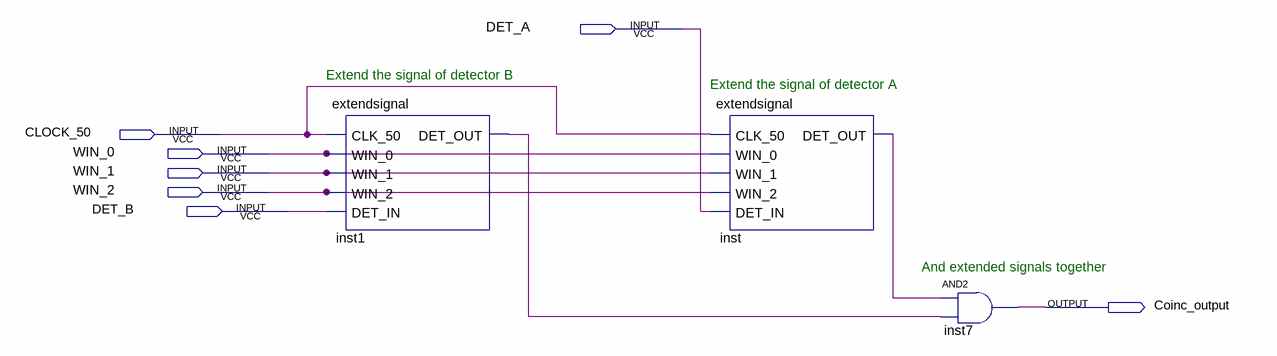
[diagram p0: schematic sheet]
// Quartus schematic coincidence_window.bdf as structural Verilog: 3 symbols, 7 pins
module coincidence_window (
  input  DET_A,
  input  CLOCK_50,
  input  WIN_0,
  input  WIN_1,
  input  WIN_2,
  input  DET_B,
  output Coinc_output
);

  wire inst1_det_out, inst_det_out;

  extendsignal inst1 (
    .CLK_50(CLOCK_50), .WIN_0(WIN_0), .WIN_1(WIN_1), .WIN_2(WIN_2), .DET_IN(DET_B), .DET_OUT(inst1_det_out));
  extendsignal inst (
    .CLK_50(CLOCK_50), .WIN_0(WIN_0), .WIN_1(WIN_1), .WIN_2(WIN_2), .DET_IN(DET_A), .DET_OUT(inst_det_out));
  and inst7 (Coinc_output, inst_det_out, inst1_det_out);

  // Notes on the sheet:
  //   Extend the signal of detector B
  //   Extend the signal of detector A
  //   And extended signals together
endmodule
